# EAGLE design Terrarium_Schematic (EAGLE 8.2.2)
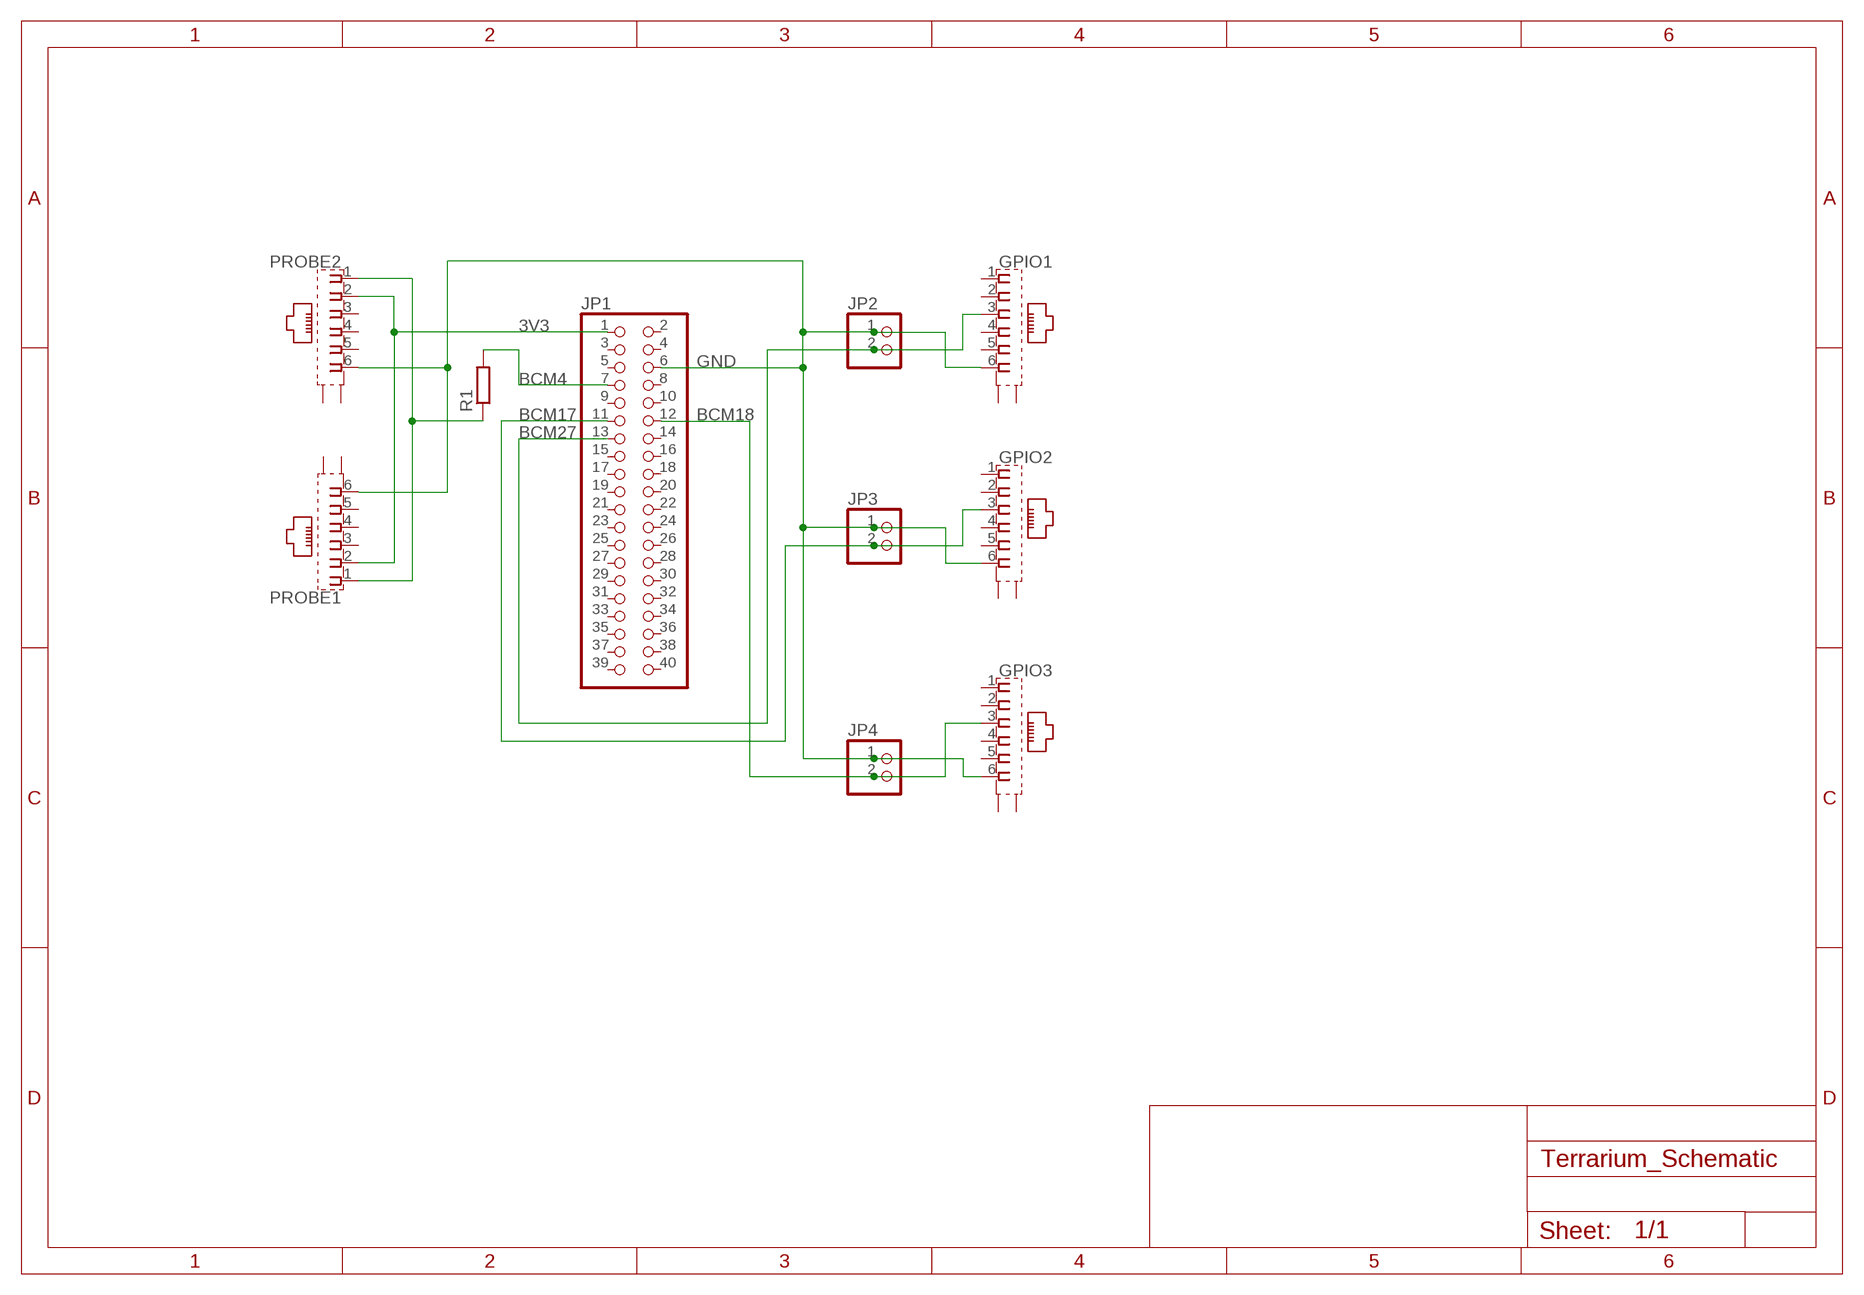
[diagram p0: schematic, sheet 1]

## Parts
GPIO1  YH-55-10  [YH-55-10]
GPIO2  YH-55-10  [YH-55-10]
GPIO3  YH-55-10  [YH-55-10]
JP1  PINHD-2X20  [2X20]
JP2  PINHD-1X2  [1X02]
JP3  PINHD-1X2  [1X02]
JP4  PINHD-1X2  [1X02]
PROBE1  YH-55-10  [YH-55-10]
PROBE2  YH-55-10  [YH-55-10]
R1  R-EU_0207/10  [0207/10]

## Nets
3V3: JP1.1 PROBE1.2 PROBE2.2
BCM4: JP1.7 R1.2
BCM17: GPIO2.3 JP1.11 JP3.2
BCM18: GPIO3.3 JP1.12 JP4.2
BCM27: GPIO1.3 JP1.13 JP2.2
GND: GPIO1.6 GPIO2.6 GPIO3.6 JP1.6 JP2.1 JP3.1 JP4.1 PROBE1.6 PROBE2.6
N$3: PROBE1.1 PROBE2.1 R1.1
Unconnected: GPIO1.1 GPIO1.2 GPIO1.4 GPIO1.5 GPIO1.S1(S) GPIO1.S2(S) GPIO2.1 GPIO2.2 GPIO2.4 GPIO2.5 GPIO2.S1(S) GPIO2.S2(S) GPIO3.1 GPIO3.2 GPIO3.4 GPIO3.5 GPIO3.S1(S) GPIO3.S2(S) JP1.2 JP1.3 JP1.4 JP1.5 JP1.8 JP1.9 JP1.10 JP1.14 JP1.15 JP1.16 JP1.17 JP1.18 JP1.19 JP1.20 JP1.21 JP1.22 JP1.23 JP1.24 JP1.25 JP1.26 JP1.27 JP1.28 JP1.29 JP1.30 JP1.31 JP1.32 JP1.33 JP1.34 JP1.35 JP1.36 JP1.37 JP1.38 JP1.39 JP1.40 PROBE1.3 PROBE1.4 PROBE1.5 PROBE1.S1(S) PROBE1.S2(S) PROBE2.3 PROBE2.4 PROBE2.5 PROBE2.S1(S) PROBE2.S2(S)

## Library data of the parts
GPIO1-GPIO3 PROBE1 PROBE2 = con-wenzhou-yihua:YH-55-10: RJ11 6 connects Source: YH-55-10.pdf; OC_FARNELL: unknown; OC_NEWARK: unknown
JP1 = pinhead:PINHD-2X20: PIN HEADER
JP2-JP4 = pinhead:PINHD-1X2: PIN HEADER
R1 = rcl:R-EU_: RESISTOR, European symbol

## Board
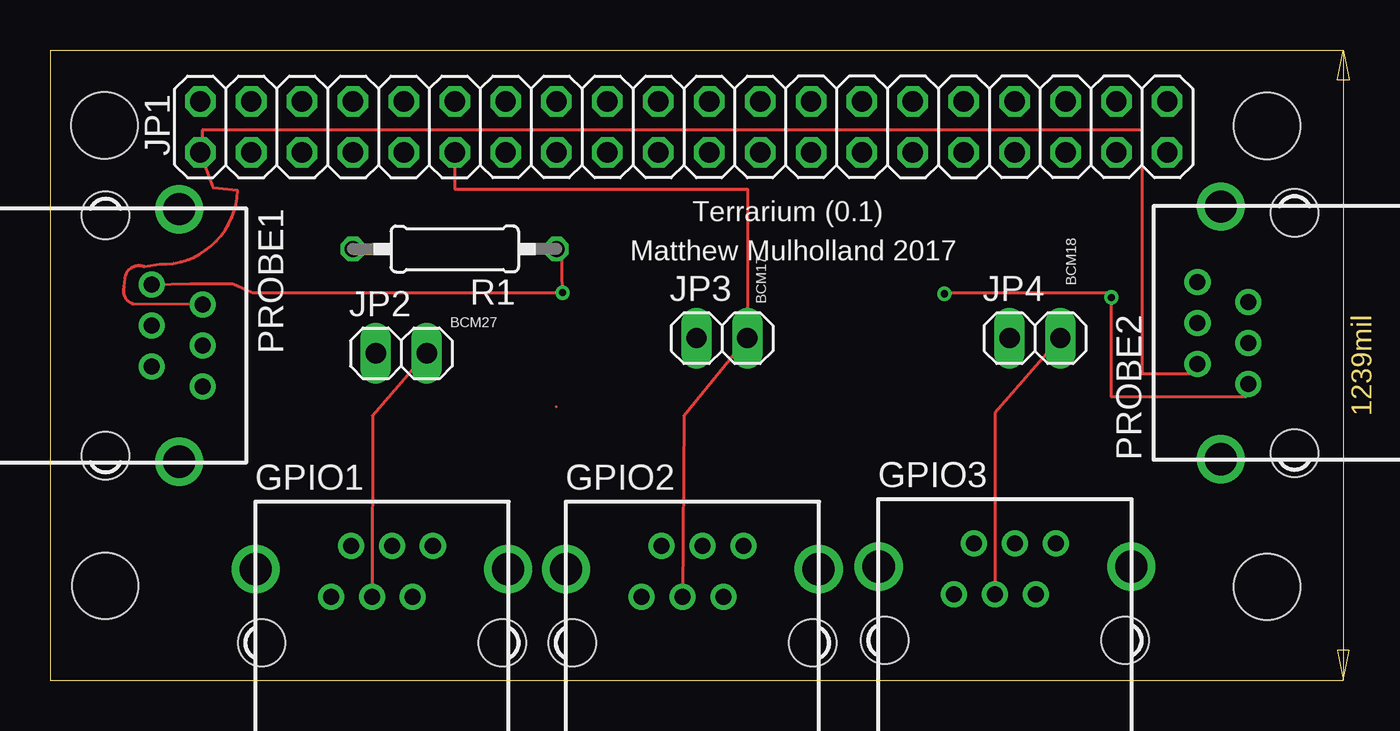
[diagram p1: board, top side]
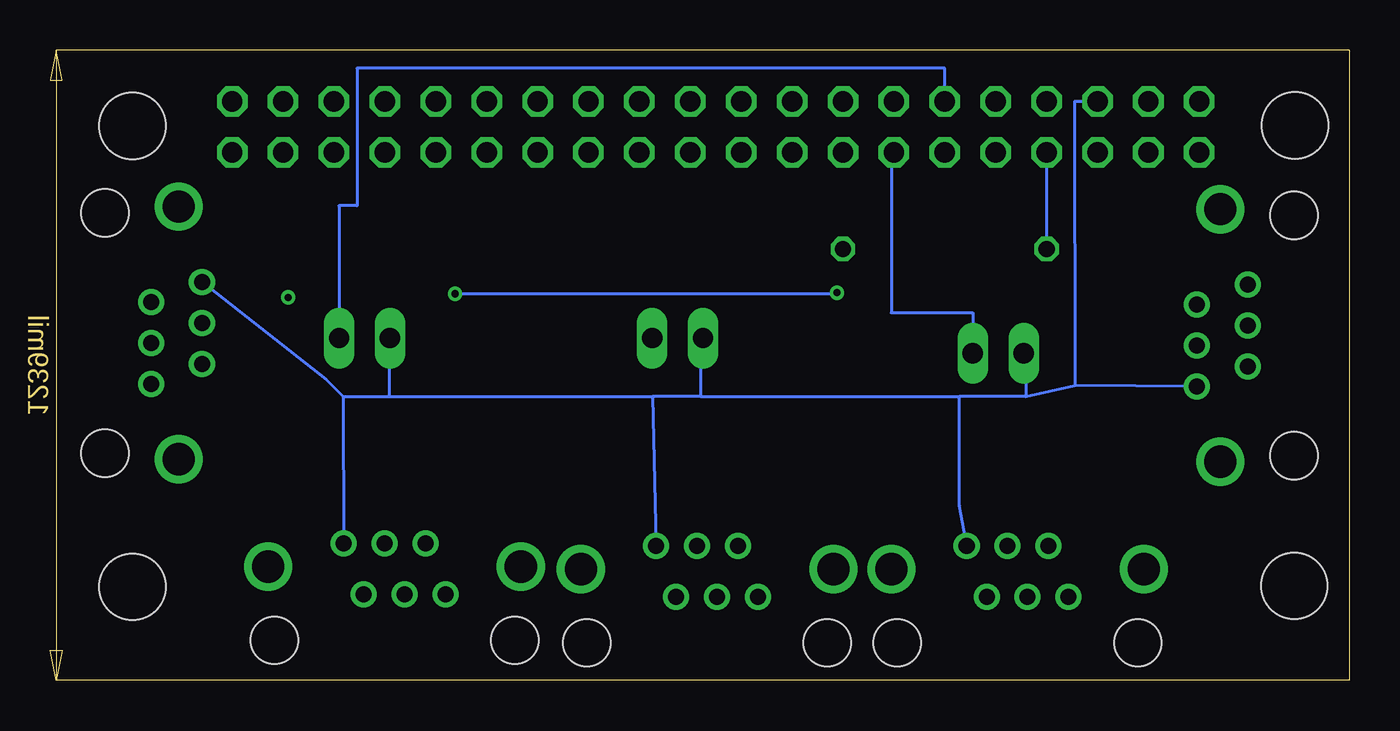
[diagram p2: board, bottom side, seen from below]

Size 64.84 x 31.47 mm. Coordinates in mm from the lower left corner, seen from the top.
Copper layers (1*16): Top 0.0356mm / dielectric 1.5011mm / Bottom 0.0356mm
Design rules "oshpark-2layer": minimum track width 6mil, minimum drill 13mil, track to track 6mil, track to pad 6mil, pad to pad 6mil, via to via 6mil, smd to smd 6mil, copper to edge 15mil, drill to drill 6mil, minimum pad ring 7mil, minimum via ring 7mil, stop-mask expansion 2.5mil, vias tented up to drill 0mil, thermal gap 10mil
Holes 3.3 mm at 2.74,4.72 2.72,27.71 60.73,27.69 60.73,4.67

### Footprints (pad centres in the part's own frame; a part is rotated, then mirrored left to right if it is on the bottom)
YH-55-10 = drill 0.8 pad 1.3: 1 -2.54,2.3; 2 -1.54,4.84; 3 -0.5,2.3; 4 0.5,4.84; 5 1.54,2.3; 6 2.54,4.84 | drill 1.6 pad 2.184: S1 -6.3,3.68; S2 6.3,3.68 | hole 2.36: -6,0; 6,0
2X20 = drill 1.016 octagon: 1 -24.13,-1.27; 2 -24.13,1.27; 3 -21.59,-1.27; 4 -21.59,1.27; 5 -19.05,-1.27; 6 -19.05,1.27; 7 -16.51,-1.27; 8 -16.51,1.27; 9 -13.97,-1.27; 10 -13.97,1.27; 11 -11.43,-1.27; 12 -11.43,1.27; 13 -8.89,-1.27; 14 -8.89,1.27; 15 -6.35,-1.27; 16 -6.35,1.27; 17 -3.81,-1.27; 18 -3.81,1.27; 19 -1.27,-1.27; 20 -1.27,1.27; 21 1.27,-1.27; 22 1.27,1.27; 23 3.81,-1.27; 24 3.81,1.27; 25 6.35,-1.27; 26 6.35,1.27; 27 8.89,-1.27; 28 8.89,1.27; 29 11.43,-1.27; 30 11.43,1.27; 31 13.97,-1.27; 32 13.97,1.27; 33 16.51,-1.27; 34 16.51,1.27; 35 19.05,-1.27; 36 19.05,1.27; 37 21.59,-1.27; 38 21.59,1.27; 39 24.13,-1.27; 40 24.13,1.27
1X02 = drill 1.016 long: 1 -1.27,0; 2 1.27,0
0207/10 = drill 0.813 octagon: 1 -5.08,0; 2 5.08,0

### Placement (x,y rotation side)
GPIO1  16.56,1.88 0 top
GPIO2  32.05,1.88 0 top
GPIO3  47.65,2.01 0 top
JP1  31.62,27.64 0 top
JP2  17.53,16.33 0 top
JP3  33.53,17.09 0 top
JP4  49.15,17.09 0 top
PROBE1  2.77,17.22 270 top
PROBE2  62.1,17.35 90 top
R1  20.19,21.54 180 top

### Tracks (layer width: path | path; a pad name or v marks a point on that pad's centre or on a via)
3V3
  Top 0.152: PROBE1.2 4.15,18.79 arc-90 3.71,19.66 3.79,20.27 arc-90 4.7,20.68 5.45,20.78 arc90 9.36,24.46 8.15,24.59 JP1.1 7.62,26.37 7.62,27.51 54.48,27.51 54.48,15.32 57.26,15.32 PROBE2.2
BCM4
  Bottom 0.152: JP1.7 R1.2
BCM17
  Top 0.152: GPIO2.3 31.63,13.22 JP3.2 34.8,24.54 20.19,24.54 JP1.11
BCM18
  Top 0.152: JP4.2 47.15,13.34 GPIO3.3
  Bottom 0.152: JP1.12 20.19,30.56 49.53,30.56 49.53,23.7 50.42,23.7 JP4.2
BCM27
  Top 0.152: JP2.2 16.09,13.22 GPIO1.3
  Bottom 0.152: JP1.13 22.86,26.37 22.86,18.36 18.8,18.36 JP2.2
GND
  Bottom 0.152: JP1.6 13.72,28.91 13.69,14.73 | PROBE1.6 13.69,14.73 | 16.16,14.17 19.46,14.17 | 16.16,14.17 13.69,14.73 | 32.38,14.17 19.46,14.17 | 32.38,14.17 34.77,14.17 | 34.77,14.17 GPIO2.6 | GPIO1.6 19.46,8.73 19.46,14.17 | 47.92,14.17 34.77,14.17 | 50.22,14.17 47.92,14.17 | 50.22,14.17 GPIO3.6 | JP2.1 16.16,16.33 16.16,14.17 | JP3.1 32.38,17.09 32.38,14.17 | JP4.1 47.92,17.09 47.92,14.17 | PROBE2.6 51.05,15.03 50.22,14.17
N$3  (via drill 0.35)
  Top 0.152: PROBE1.1 7,19.81 9.11,19.81 10.11,19.36 v25.58,19.36 25.53,21.54 R1.1 | PROBE2.1 59.68,14.17 56.9,14.17 56.89,14.17 52.96,14.17 v52.96,19.13 52.96,19.33 44.65,19.33 v44.63,19.3
  Bottom 0.152: v44.63,19.3 25.63,19.3 v25.58,19.36
S$2
  Top 0.152: 25.27,13.67 25.27,13.66

### Text on the board
tPlace: Terrarium (0.1) | Matthew Mulholland 2017 | BCM18 | BCM17 | BCM27